# Altium project Thermostat_EEM_Fan_board.PrjPCB
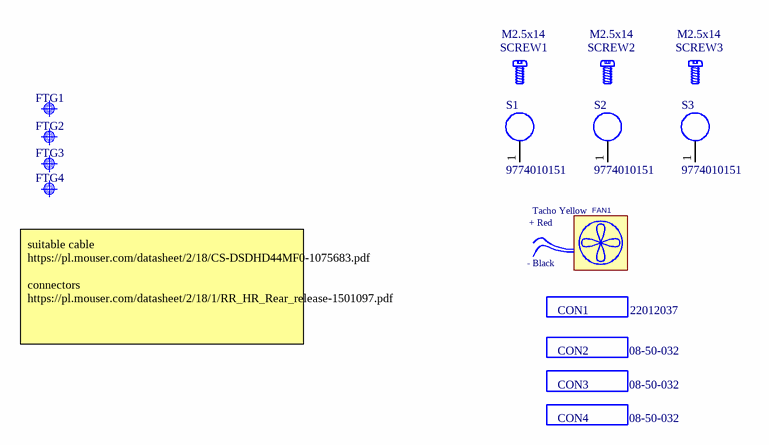
[diagram p0: Thermostat_EEM_Fan_board.SchDoc]
rev: 1.0.1
1 sheet, 15 parts. Net scope: global (net labels, ports and power ports of the same name join across sheets).
Board file: Thermostat_EEM_Fan_board.PCBDOC

## Sheet Thermostat_EEM_Fan_board.SchDoc: Thermostat EEM
size 420 x 297 mm; Author: G.Kasprowicz; CompanyName: WUT ISE; DrawnBy: G.Kasprowicz; Organization: WUT ISE; Address1: PW ISE; Address2: Nowowiejska 15/19 00-665 Warsaw; Address3: gkasprow@gmail.com; DocumentNumber: 1; Revision: 2; SheetNumber: 1; SheetTotal: 9; ModifiedBy: -; CheckedDate: -; Title2: Fan board; DivGrp: WUT ISE; Designer: G.Kasprowicz; ModifiedDate: -; ProjectName: Sensor Box

### Parts
CON1  22012037  (mechanical)
CON2  08-50-032  (mechanical)
CON3  08-50-032  (mechanical)
CON4  08-50-032  (mechanical)
FAN1  Fan No Pin  [FAN_SUNON_MF35101V1-G99-A]  (value not drawn)
FTG1  Use only in PCB  [FIDUCIAL_TOP_C100-200]  (value not drawn)
FTG2  Use only in PCB  [FIDUCIAL_TOP_S100-200]  (value not drawn)
FTG3  Use only in PCB  [FIDUCIAL_TOP_S100-200]  (value not drawn)
FTG4  Use only in PCB  [FIDUCIAL_TOP_S100-200]  (value not drawn)
S1  9774010151  [9774010151]
S2  9774010151  [9774010151]
S3  9774010151  [9774010151]
SCREW1  M2.5x14  [KRAFTBERG_M2.5X14/D7985-A2_v]
SCREW2  M2.5x14  [KRAFTBERG_M2.5X14/D7985-A2_v]
SCREW3  M2.5x14  [KRAFTBERG_M2.5X14/D7985-A2_v]

### Nets

Not connected (* = marked no-connect by the designer): S1 1; S2 1; S3 1

### Notes on the sheet
- (near FTG4) suitable cable https://pl.mouser.com/datasheet/2/18/CS-DSDHD44MF0-1075683.pdf
  connectors
  https://pl.mouser.com/datasheet/2/18/1/RR_HR_Rear_release-1501097.pdf
- Project/Equipment
- Document
- Designer
- Drawn by
- Check.by
- Copyright WUT ISE 2024.
  This documentation describes Open Hardware and is licensed under the CERN OHL-W v.2.0. You may redistribute and modify this documentation under the terms of the CERN OHL-W v.2.0. (http://ohwr.org/CERNOHL). This documentation is distributed WITHOUT ANY EXPRESS OR IMPLIED WARRANTY, INCLUDING OF MERCHANTABILITY, SATISFACTORY QUALITY AND FITNESS FOR A PARTICULAR PURPOSE. Please see the CERN OHL v.2.0 for applicable conditions.
- Contact
- File
- Last Mod.
- Print Date
- Sheet
- Size
- A3
- of
- Rev
- (in symbol Fan No Pin) Tacho Yellow; + Red; - Black

### Library data of the parts
CON1 = Generic_mechanical: Conn Housing RCP 3 POS 2.54mm Crimp ST Cable Mount White KK® Bag; Manufacturer: Molex; PressFit: No; Value: 750mm; Part Number: 22012037; Component Type: Standard; Footprint: 22012037; Pin Count: 0; PackageDescription: generic; Mounted: Yes; Socket: No; SMD: No; Sense: No; Status: None; Part Description: Conn Housing RCP 3 POS 2.54mm Crimp ST Cable Mount White KK® Bag; Manufacturer Part Number: 22012037; ComponentHeight: generic; Author: GK; CreateDate: 28.10.2019; LatestRevisionDate: 28.10.2019
CON2-CON4 = Generic_mechanical: KK contact; Manufacturer: Molex; PressFit: No; Value: 750mm; Part Number: 08-50-032; Component Type: Standard; Footprint: 08-50-032; Pin Count: 0; PackageDescription: generic; Mounted: Yes; Socket: No; SMD: No; Sense: No; Status: None; Part Description: KK contact; Manufacturer Part Number: 08-50-032; ComponentHeight: generic; Author: GK; CreateDate: 28.10.2019; LatestRevisionDate: 28.10.2019
FAN1 = Fan No Pin: 12VDC, 28.0dB(A),  35x 35 x 10mm Axial Fan with Tacho; Part Number: FAN_SUNON_MF35101V1-1000U-G99; Part Description: 5VDC, 9500RPM, 30 x 30 x 6mm Axial Fan with Tacho; Manufacturer: SUNON; Manufacturer Part Number: MF35101V1-1000U-G99; PressFit: No; Component Kind: Accessories; Component Type: Standard; Pin Count: 0; PackageDescription: 12VDC, 28.0dB(A),  35x 35 x 10mm Axial Fan; Mounted: Yes; Socket: No; SMD: No; Sense: No; Status: None; ComponentHeight: 6.9mm; HelpURL: \\cern.ch\dfs\Applications\Altium\Datasheets\SUNON_MC30060V1-000U-A99.pdf; Author: CERN DEM JLC; CreateDate: 26.01.2015; LatestRevisionDate: 26.01.2015
FTG1 = FIDUCIAL_TARGET_C100-200: Fiducial Target; Part Description: Round Fiducial Target, Top Layer, 1.0mm, Top Solder 2.0mm, Keepout =2.0mm; Mounted: No; Part Number: FIDUCIAL_TARGET_C100-200; Component Kind: Standard (No BOM); Component Type: Standard (No BOM); Pin Count: 1; Family: Fiducial; Socket: No; SMD: Yes; Sense: No; Status: None; ComponentHeight: 0mm; HelpURL: Undefined; Author: CERN DEM JLC; CreateDate: 09.02.2010; LatestRevisionDate: 04.04.2012; PackageDescription: Round Fiducial Target, Top Layer, 1.0mm, Top Solder 2.0mm, Keepout =2.0mm
FTG2-FTG4 = FIDUCIAL_TARGET_S100-200: Fiducial Target; Part Description: Square Fiducial Target, Top Layer, 1.0mm, Top Solder 2.0mm, Keepout =2.0mm; Mounted: No; Part Number: FIDUCIAL_TARGET_S100-200; Component Kind: Standard (No BOM); Component Type: Standard (No BOM); Pin Count: 1; Family: Fiducial; Socket: No; SMD: Yes; Sense: No; Status: None; ComponentHeight: 0mm; HelpURL: Undefined; Author: CERN DEM JLC; CreateDate: 09.02.2010; LatestRevisionDate: 04.04.2012; PackageDescription: Square Fiducial Target, Top Layer, 1.0mm, Top Solder 2.0mm, Keepout =2.0mm
S1-S3 = WA-SMSI,  9774010151: WA-SMSI SMD Steel Spacer with internal Thread; Manufacturer: Wurth Elektronik; Manufacturer Part Number: 9774010151; ComponentLink1Description: Manufacturer; ComponentLink1URL: http://www.we-online.de; Created by: Baojun Chen; Created Date: 20.Oct.2015; ComponentLink2Description: Datasheet; ComponentLink2URL: http://katalog.we-online.de/em/datasheet/9774010151.pdf
SCREW1-SCREW3 = Screw_M2.5x14: M2.5 L=14mm Hexalobular Socket Pan Head Screw, Fully Threaded, Stainless Steel A2; Manufacturer: Kraftberg; Manufacturer Part Number: M2.5X14/D7985-A2; PressFit: No; Part Number: KRAFTBERG_M2.5X14/D7985-A2_v; Component Kind: Standard; Component Type: Mechanical; Footprint: KRAFTBERG_M2.5X14/D7985-A2; Pin Count: 0; PackageDescription: M2.5 L=14mm Hexalobular Socket Pan Head Screw, Fully Threaded - Stainless Steel A2; Mounted: Yes; Socket: No; SMD: No; Sense: No; Status: None; Value: M2.5x14; Part Description: M2.5 L=14mm Hexalobular Socket Pan Head Screw, Fully Threaded, Stainless Steel A2; ComponentHeight: 2.1mm; HelpURL: \\cern.ch\dfs\Applications\Altium\Datasheets\BOSSARD_BN5687-3061601.pdf; Author: GK; CreateDate: 15.01.2013; LatestRevisionDate: 15.01.2013

## Assembly variants
Default: not fitted IC23 IC36 IC39 IC40 IC41 J4 R126_1 R126_2 R126_3 R126_4 R127_1 R127_2 R127_3 R127_4 W2